# EAGLE design kilafors_rev_A (EAGLE 6.5.0)
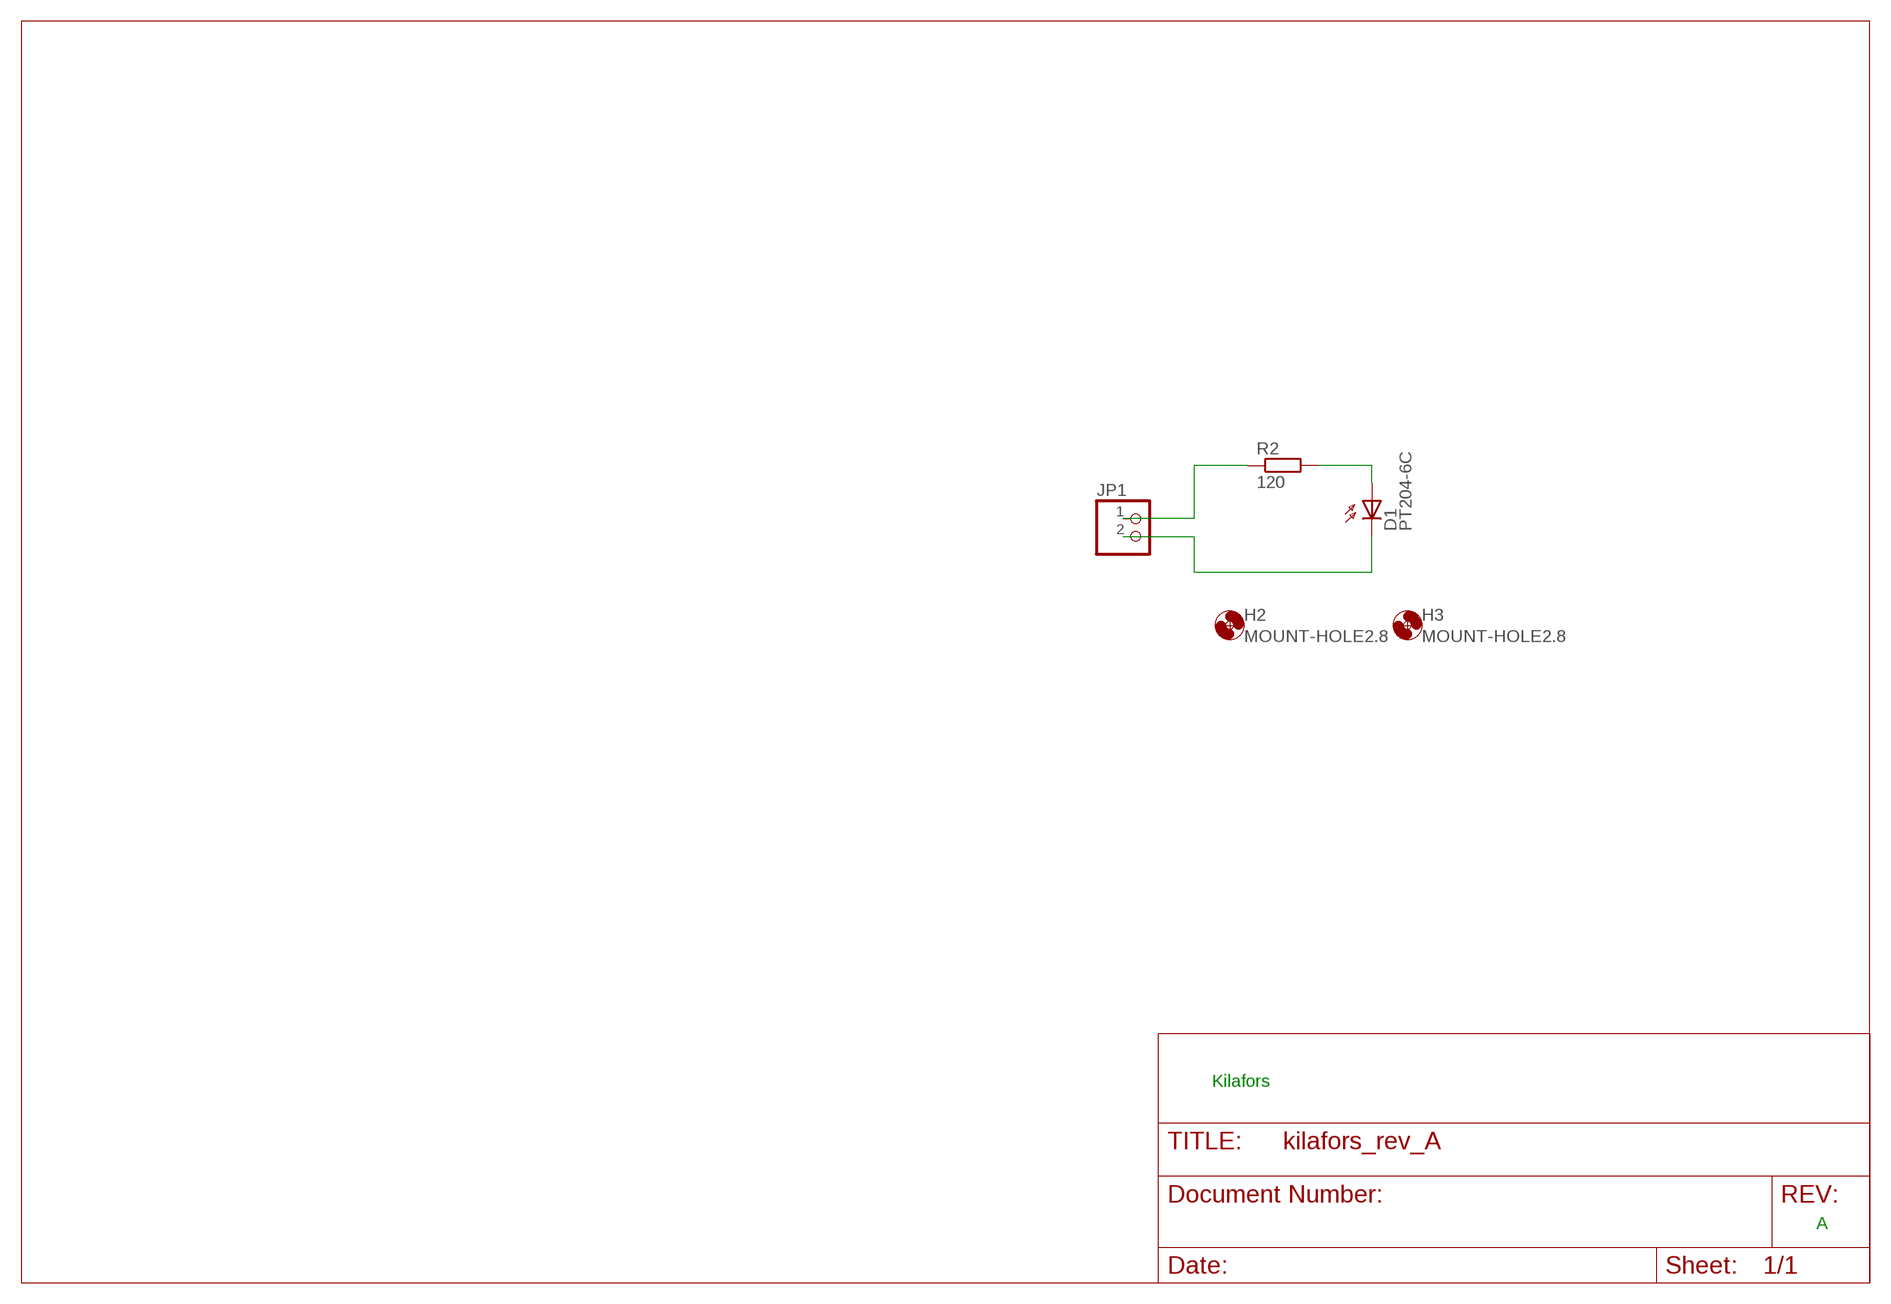
[diagram p0: schematic, sheet 1]

## Parts
D1  PT204-6C  BPW32  [BPW32]
H2  MOUNT-HOLE2.8  [2,8]
H3  MOUNT-HOLE2.8  [2,8]
JP1  PINHD-1X2  [1X02]
R2  120  R-EU_0204/5  [0204/5]

## Nets
N$1: D1.A R2.2
N$2: JP1.1 R2.1
N$3: D1.K(C) JP1.2

## Notes on the sheet
- Kilafors
- A

## Library data of the parts
D1 = opto-trans-siemens:BPW32: PHOTO DIODE; OC_FARNELL: unknown; OC_NEWARK: unknown
H2 H3 = holes:MOUNT-HOLE: MOUNTING HOLE with drill center marker
JP1 = pinhead:PINHD-1X2: PIN HEADER
R2 = resistor:R-EU_: RESISTOR, European symbol

## Board
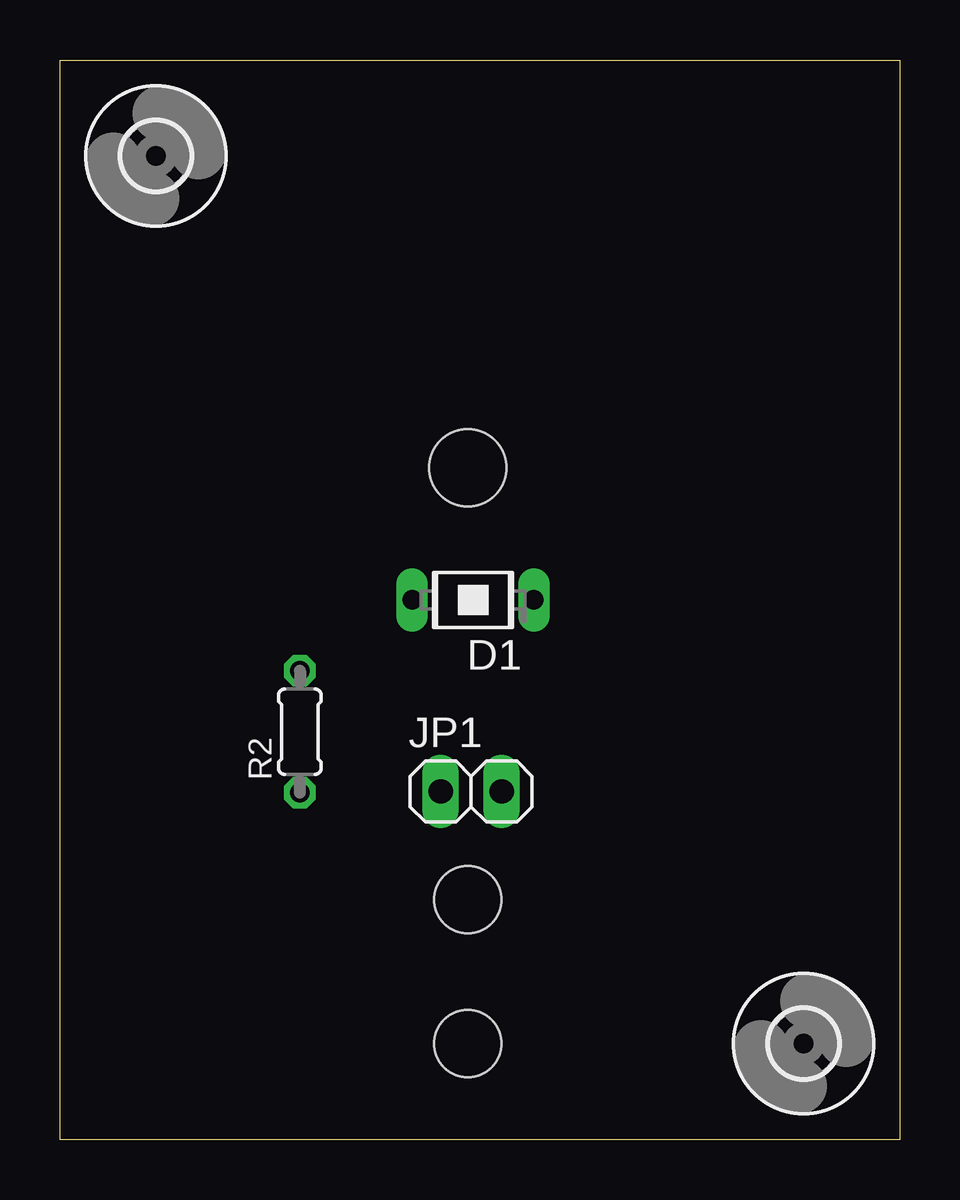
[diagram p1: board, top side]
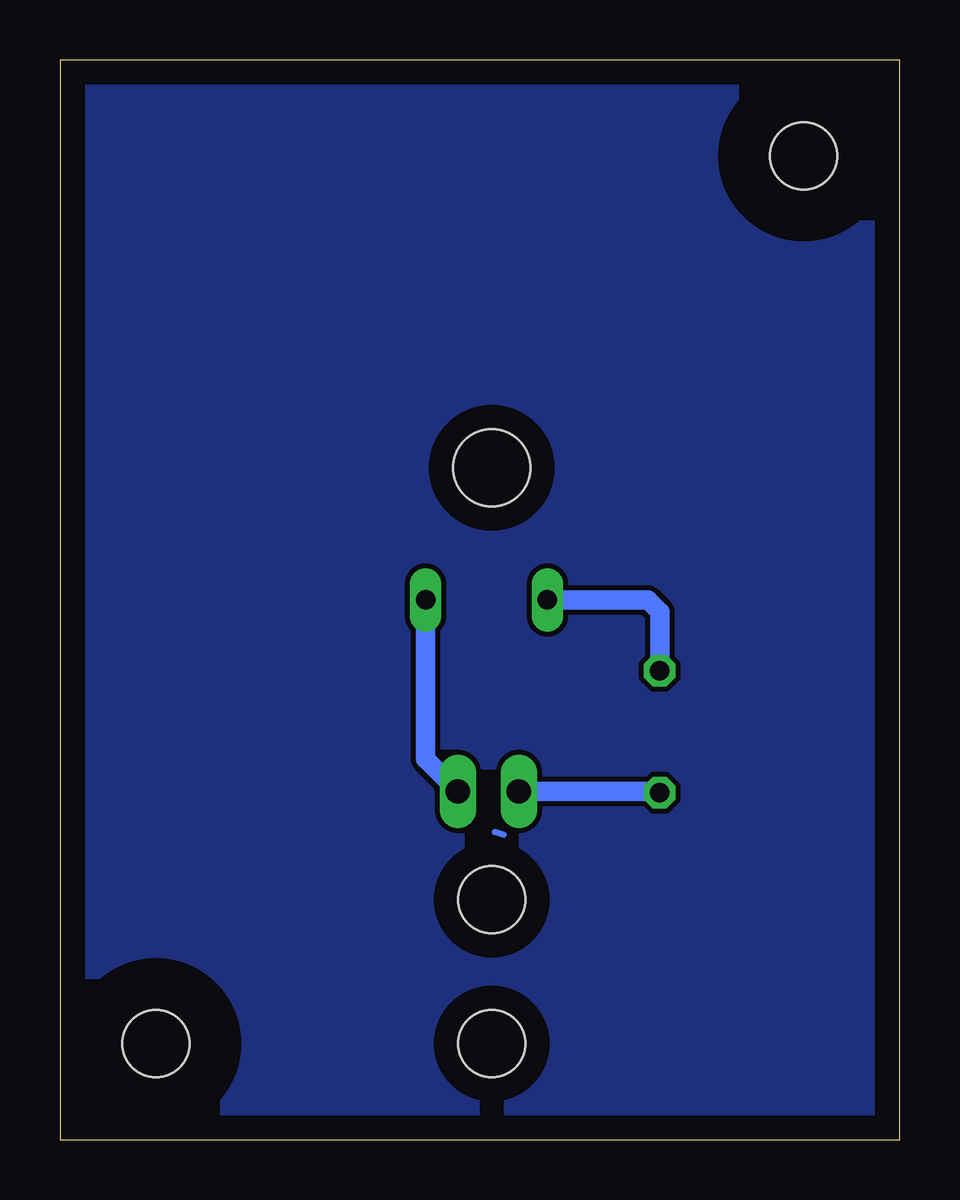
[diagram p2: board, bottom side, seen from below]

Size 35 x 45 mm. Coordinates in mm from the lower left corner, seen from the top.
Outline: 0,0 0,45 35,45 35,0 0,0
Copper layers (1*16): Top 0.035mm / dielectric 1.5mm / Bottom 0.035mm
Design rules "default": minimum track width 10mil, minimum drill 24mil, track to track 8mil, track to pad 8mil, pad to pad 8mil, via to via 8mil, smd to smd 8mil, copper to edge 40mil, drill to drill 8mil, minimum pad ring 10mil, minimum via ring 8mil, stop-mask expansion 4mil, vias tented up to drill 0mil, thermal gap 10mil
Holes 2.8 mm at 17,10 17,4
Holes 3.2 mm at 17,28

### Footprints (pad centres in the part's own frame; a part is rotated, then mirrored left to right if it is on the bottom)
BPW32 = drill 0.813 long: A 0,2.54; K 0,-2.54
2,8 = hole 2.8: 0,0
1X02 = drill 1.016 long: 1 -1.27,0; 2 1.27,0
0204/5 = drill 0.813 octagon: 1 -2.54,0; 2 2.54,0

### Placement (x,y rotation side)
D1  17.22,22.49 90 top
H2  31,4 0 top
H3  4,41 0 top
JP1  17.14,14.51 0 top
R2  10,17 90 top

### Tracks (layer width: path | path; a pad name or v marks a point on that pad's centre or on a via)
GND
  pour Bottom: 1,44 1,1 34,1 34,44
N$1
  Bottom 0.813: D1.A 10.49,22.49 10,22 R2.2
N$2
  Bottom 0.813: JP1.1 10.05,14.51 R2.1
N$3
  Bottom 0.813: D1.K 19.76,15.86 JP1.2
N$4
  Bottom 0.254: 16.51,12.7 16.88,12.82

### Text on the board
tValues: Kilafors | Rev A | www.grodansparadis.com